# Altium schematic sheet [04].LORA.SchDoc
size A; Organization: Altium Limited; Address1: L3, 12a Rodborough Rd; Address2: Frenchs Forest; Address3: NSW; Address4: Australia 2086
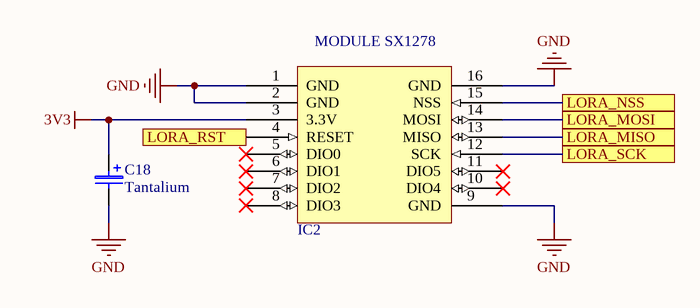
[diagram p0: [04].LORA.SchDoc]

## Parts
C18  Tantalium  [Case A]
IC2  MODULE SX1278  [LORA_RA01]

## Ports
LORA_MISO, LORA_MOSI, LORA_NSS, LORA_RST, LORA_SCK

## Nets
3V3: C18.A IC2.3(3.3V)
GND: C18.K IC2.1(GND) IC2.2(GND) IC2.9(GND) IC2.16(GND)
LORA_MISO: IC2.13(MISO) ; port LORA_MISO
LORA_MOSI: IC2.14(MOSI) ; port LORA_MOSI
LORA_NSS: IC2.15(NSS) ; port LORA_NSS
LORA_RST: IC2.4(RESET) ; port LORA_RST
LORA_SCK: IC2.12(SCK) ; port LORA_SCK

Not connected (* = marked no-connect by the designer): IC2 5(DIO0)* 6(DIO1)* 7(DIO2)* 8(DIO3)* 10(DIO4)* 11(DIO5)*

## Notes on the sheet
- Title
- Size:
- Date:
- A
- Number:
- Time:
- Revision:
- Sheet
- of
- File:

## Library data of the parts
C18 = CASE A
IC2 = SX1278IMLTRT: IC RF TXRX 802.15.4 28VQFN; Manufacturer: Semtech Corporation; Manufacturer Part Number: SX1278_Ra01; ID: 8; Detailed Description: IC RF TxRx Only 802.15.4 LoRa™ 137MHz ~ 1.02GHz 28-VQFN Exposed Pad; Part Number: SX1278IMLTRT; Component Kind: Standard; Component Type: Standard; Device: MODULE SX1278; Footprint: VQFN Exposed Pad; Pin Count: 16; Case: 16 VQFN Exposed Pad; Mounted: Yes; Socket: No; SMD: Yes; HelpURL: https://www.mouser.vn; Author: MDBK